# EAGLE design Placa principal (EAGLE 7.6.0)
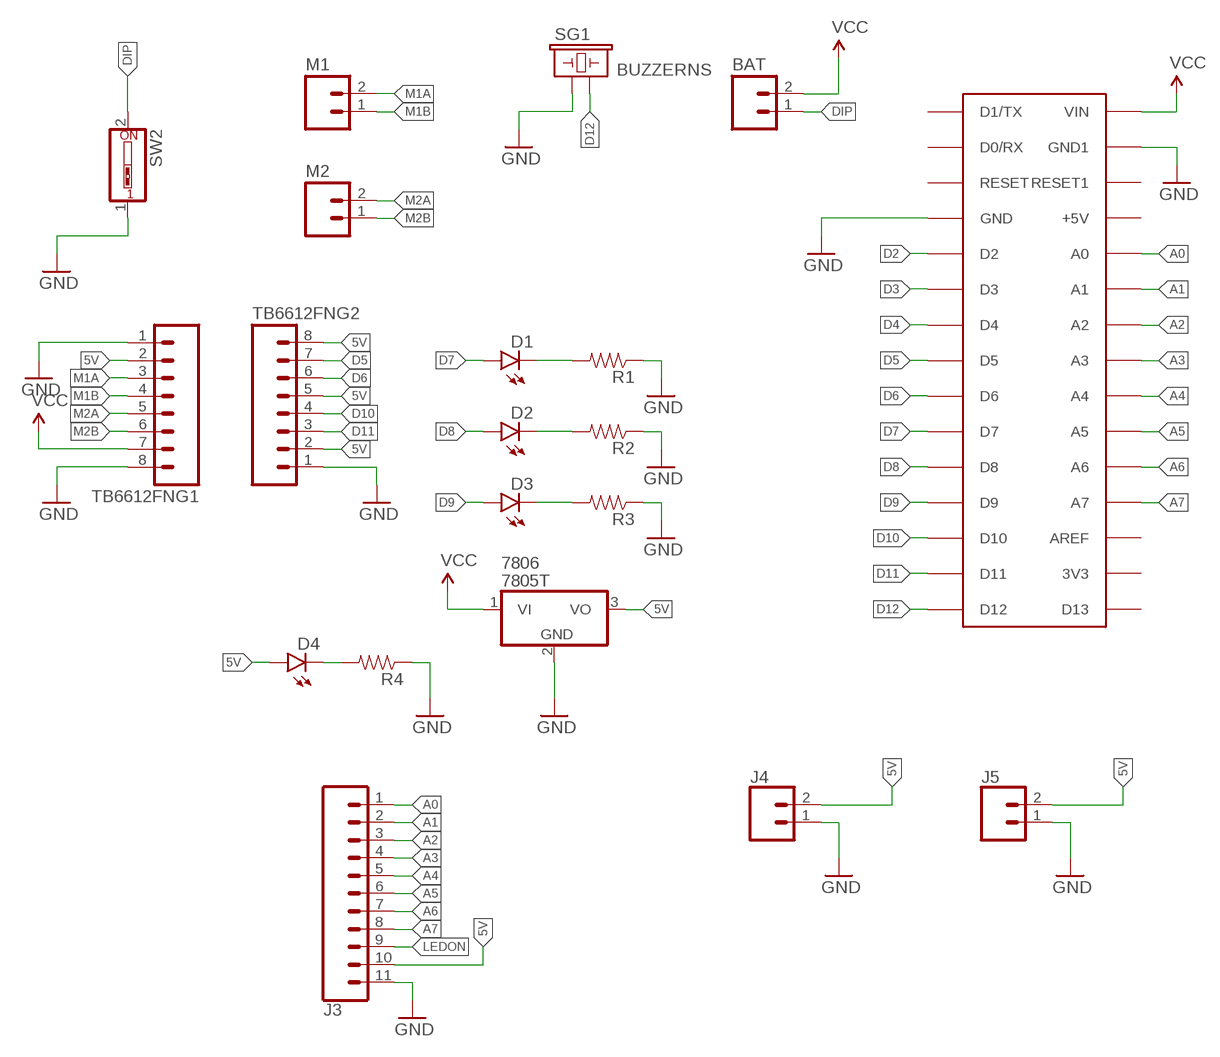
[diagram p0: schematic, sheet 1]

## Parts
7806  7805T  [TO220H]
BAT  M02PTH  [1X02@1]
D1  LED5MM  [LED5MM]
D2  LED5MM  [LED5MM]
D3  LED5MM  [LED5MM]
D4  LED5MM  [LED5MM]
J3  CONN_11  [1X11]
J4  CONN_02  [1X02]
J5  CONN_02  [1X02]
M1  M02JST-PTH-VERT  [JST-2-PTH-VERT]
M2  M02JST-PTH-VERT  [JST-2-PTH-VERT]
R1  RESISTOREZ  [AXIAL-0.3EZ]
R2  RESISTOREZ  [AXIAL-0.3EZ]
R3  RESISTOREZ  [AXIAL-0.3EZ]
R4  RESISTOREZ  [AXIAL-0.3EZ]
SG1  BUZZERNS  [BUZZER-12MM-NS]
SW2  SW_DIP-1  [EDG-01]
TB6612FNG1  M08  [1X08_ROUND]
TB6612FNG2  M08  [1X08_ROUND]
U1  NANO  ARDUINONANO  [PDIP-32]

## Nets
5V: 7806.3(VO) D4.A J3.10 J4.2 J5.2 TB6612FNG1.2 TB6612FNG2.2 TB6612FNG2.5 TB6612FNG2.8
A0: J3.1 U1.A0
A1: J3.2 U1.A1
A2: J3.3 U1.A2
A3: J3.4 U1.A3
A4: J3.5 U1.A4
A5: J3.6 U1.A5
A6: J3.7 U1.A6
A7: J3.8 U1.A7
D2: U1.D2
D3: U1.D3
D4: U1.D4
D5: TB6612FNG2.7 U1.D5
D6: TB6612FNG2.6 U1.D6
D7: D1.A U1.D7
D8: D2.A U1.D8
D9: D3.A U1.D9
D10: TB6612FNG2.4 U1.D10
D11: TB6612FNG2.3 U1.D11
D12: SG1.- U1.D12
DIP: BAT.1 SW2.2
GND: 7806.2(GND) J3.11 J4.1 J5.1 R1.P$1 R2.P$1 R3.P$1 R4.P$1 SG1.+ SW2.1 TB6612FNG1.1 TB6612FNG1.8 TB6612FNG2.1 U1.GND U1.GND1
LEDON: J3.9
M1A: M1.2 TB6612FNG1.3
M1B: M1.1 TB6612FNG1.4
M2A: M2.2 TB6612FNG1.5
M2B: M2.1 TB6612FNG1.6
N$2: D4.K(C) R4.P$2
N$4: D1.K(C) R1.P$2
N$5: D2.K(C) R2.P$2
N$6: D3.K(C) R3.P$2
VCC: 7806.1(VI) BAT.2 TB6612FNG1.7 U1.VIN
Unconnected: U1.3V3 U1.+5V U1.AREF U1.D0/RX U1.D1/TX U1.D13 U1.RESET U1.RESET1

## Library data of the parts
7806 = linear:78*: Positive VOLTAGE REGULATOR Source: http://cache.national.com/ds/LM/LM78L05.pdf http://www.fairchildsemi.com/ds/LM/LM7805.pdf
BAT M1 M2 = SparkFun-Connectors:M02: Standard 2-pin 0.1" header. Use with - straight break away headers ( PRT-00116) - right angle break away headers (PRT-00553) - swiss pins (PRT-00743) - machine pins (PRT-00117) - female headers (PRT-00115) Molex polarized connector foot print use with: PRT-08233 with associated crimp pins and housings. 2.54_SCREWTERM for use with PRT-10571. 3.5mm Screw Terminal footprints for PRT-08084 5mm Screw Terminal footprints for use with PRT-08432
D1-D4 = SparkFun-LED:LED: LEDs Standard schematic elements and footprints for 5mm, 3mm, 1206, and 0603 sized LEDs. 5mm - Spark Fun Electronics SKU : COM-00529 (and others)
J3 = SparkFun-Connectors:CONN_11: Multi connection point. Often used as Generic Header-pin footprint for 0.1 inch spaced/style header connections On any of the 0.1 inch spaced packages, you can populate with these: Break Away Headers - Straight <https://www.sparkfun.com/products/116> (PRT-00116) Break Away Male Headers - Right Angle <https://www.sparkfun.com/products/553> (PRT-00553) Female Headers <https://www.sparkfun.com/products/115> (PRT-00115) Break Away Headers - Machine Pin <https://www.sparkfun.com/products/117> (PRT-00117) Break Away Female Headers - Swiss Machine Pin <https://www.sparkfun.com/products/743> (PRT-00743) For SCREWTERMINALS and SPRING TERMINALS visit here: Screw Terimnals on SparkFun.com <https://www.sparkfun.com/search/results?term=Screw+Terminals> (5mm/3.5mm/2.54mm spacing) This device is also useful as a general connection point to wire up your design to another part of your project. Our various solder wires solder well into these plated through hole pads. Hook-Up Wire - Assortment (Stranded, 22 AWG) <https://www.sparkfun.com/products/11375> (PRT-11375) Hook-Up Wire - Assortment (Solid Core, 22 AWG) <https://www.sparkfun.com/products/11367> (PRT-11367) View the entire wire category on our website here <https://www.sparkfun.com/categories/141>
J4 J5 = SparkFun-Connectors:CONN_02: Multi connection point. Often used as Generic Header-pin footprint for 0.1 inch spaced/style header connections On any of the 0.1 inch spaced packages, you can populate with these: Break Away Headers - Straight <https://www.sparkfun.com/products/116> (PRT-00116) Break Away Male Headers - Right Angle <https://www.sparkfun.com/products/553> (PRT-00553) Female Headers <https://www.sparkfun.com/products/115> (PRT-00115) Break Away Headers - Machine Pin <https://www.sparkfun.com/products/117> (PRT-00117) Break Away Female Headers - Swiss Machine Pin <https://www.sparkfun.com/products/743> (PRT-00743) For SCREWTERMINALS and SPRING TERMINALS visit here: Screw Terimnals on SparkFun.com <https://www.sparkfun.com/search/results?term=Screw+Terminals> (5mm/3.5mm/2.54mm spacing) This device is also useful as a general connection point to wire up your design to another part of your project. Our various solder wires solder well into these plated through hole pads. Hook-Up Wire - Assortment (Stranded, 22 AWG) <https://www.sparkfun.com/products/11375> (PRT-11375) Hook-Up Wire - Assortment (Solid Core, 22 AWG) <https://www.sparkfun.com/products/11367> (PRT-11367) View the entire wire category on our website here <https://www.sparkfun.com/categories/141> Special notes: Molex polarized connector foot print use with: PRT-08233 with associated crimp pins and housings. 2.54_SCREWTERM for use with PRT-10571. 3.5mm Screw Terminal footprints for PRT-08084 5mm Screw Terminal footprints for use with PRT-08432
R1-R4 = SparkFun-Resistors:RESISTOR: Resistor Basic schematic elements and footprints for 0603, 1206, and PTH resistors.
SG1 = SparkFun-Electromechanical:BUZZER: Buzzer 12mm Spark Fun Electronics SKU : Comp-Buzzer
SW2 = special:SW_DIP-1: DIP SWITCH
TB6612FNG1 TB6612FNG2 = SparkFun-Connectors:M08: Header 8 Standard 8-pin 0.1" header. Use with straight break away headers (SKU : PRT-00116), right angle break away headers (PRT-00553), swiss pins (PRT-00743), machine pins (PRT-00117), and female headers (PRT-00115).; PROD_ID: CONN-08437
U1 = jet-lib:ARDUINONANO

## Board
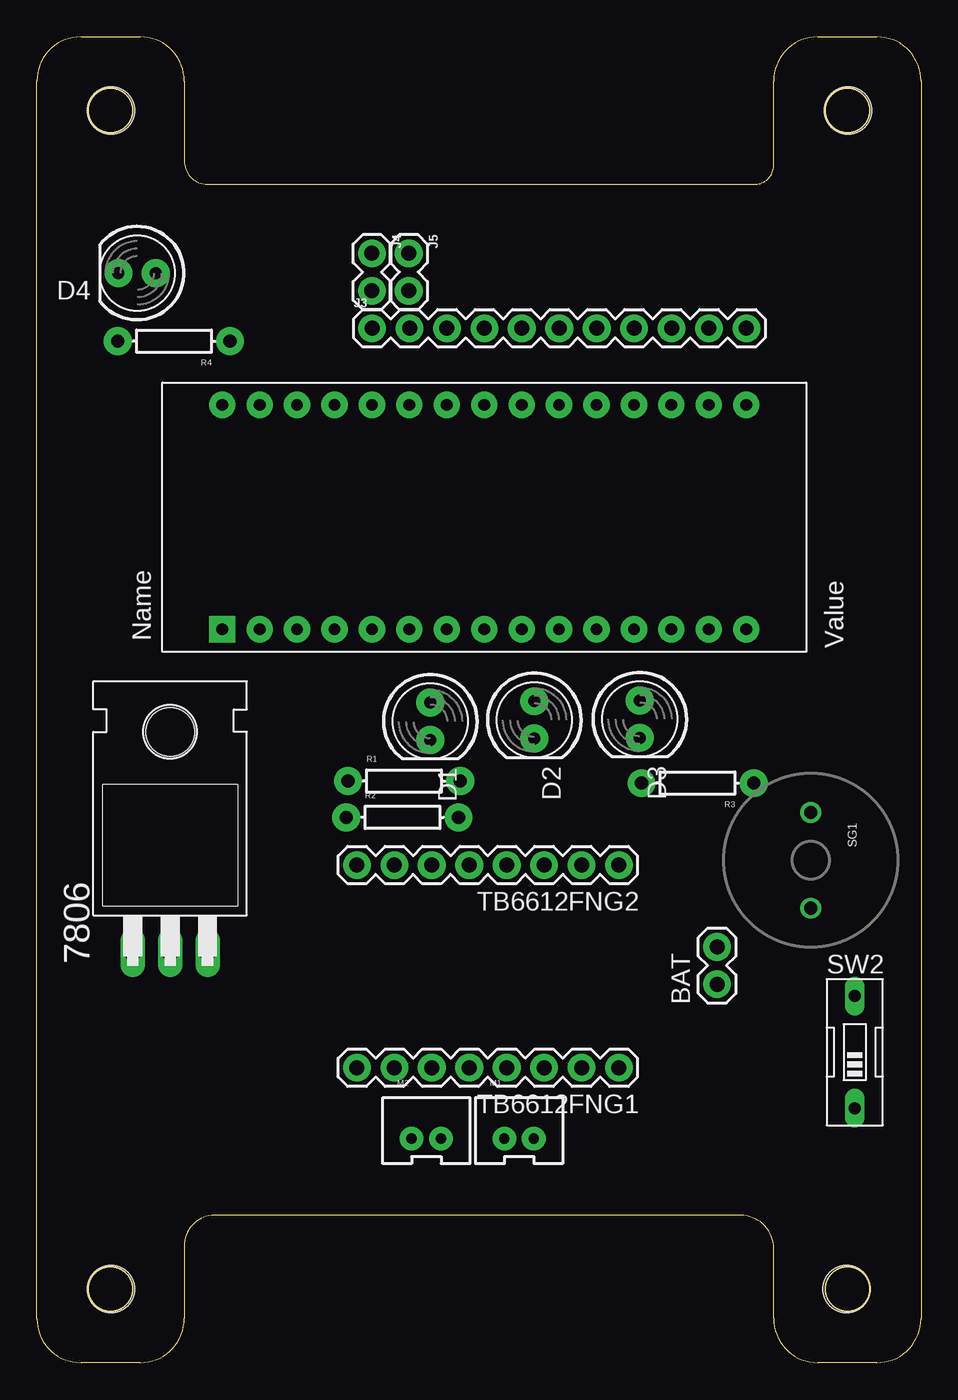
[diagram p1: board, top side]
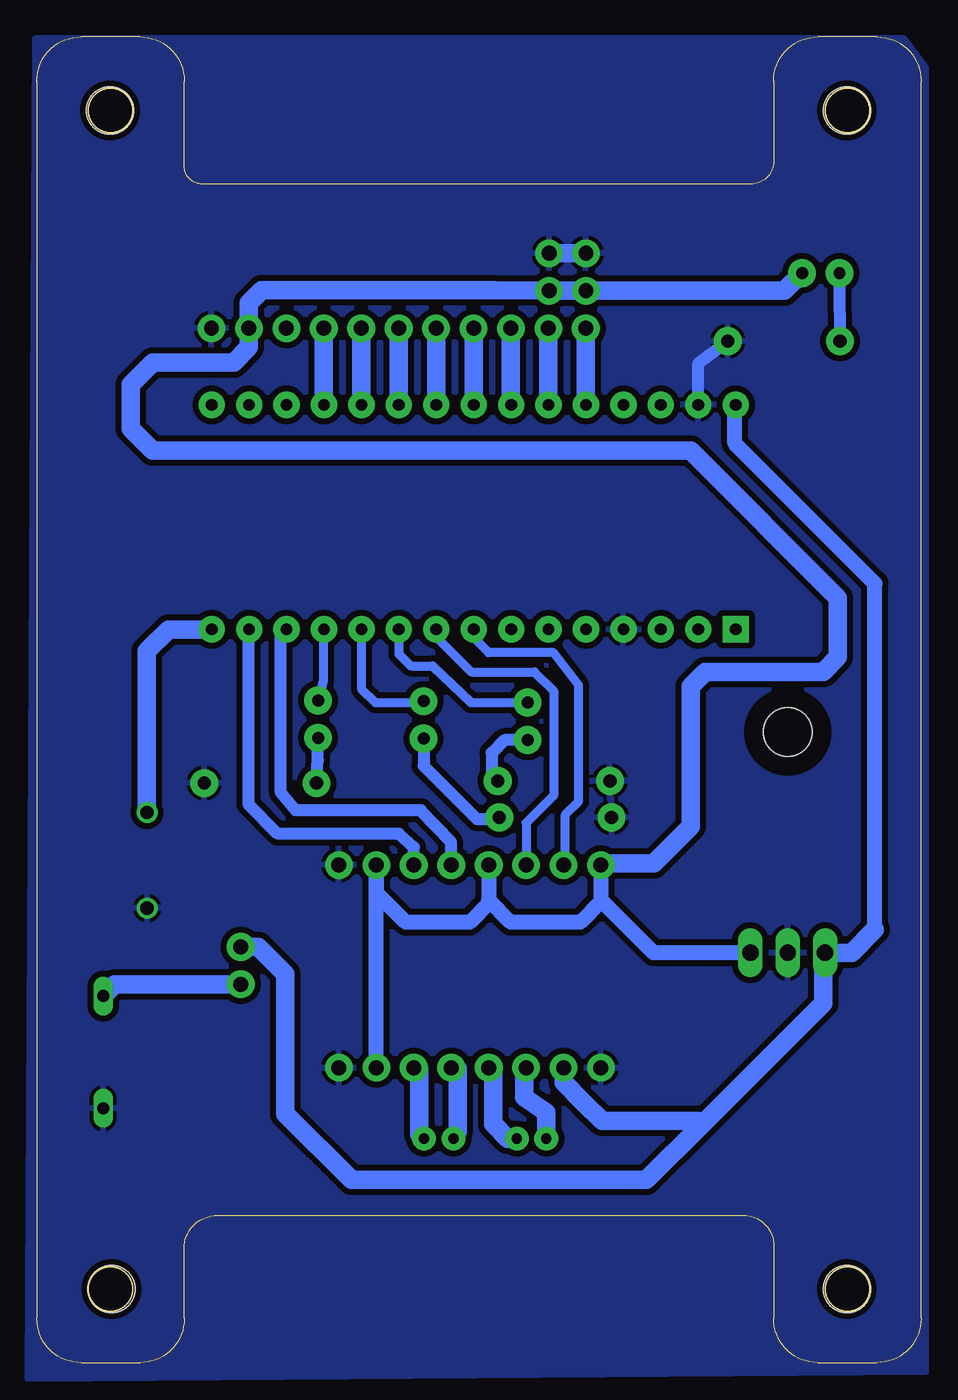
[diagram p2: board, bottom side, seen from below]

Size 60 x 90 mm. Coordinates in mm from the lower left corner, seen from the top.
Outline: 53,90 57,90 arc-90 60,87 60,3 arc-90 57,0 53,0 arc-90 50,3 50,7.75 arc90 47.75,10 12.06,10 arc90 10,7.94 10,3 arc-90 7,0 3,0 arc-90 0,3 0,87 arc-90 3,90 7,90 arc-90 10,87 10,81.57 arc90 11.57,80 48.75,80 arc90 50,81.25 50,87 arc-90 53,90
Outline: circle at 5,85 radius 1.5
Outline: circle at 55,5 radius 1.5
Outline: circle at 55,85 radius 1.5
Outline: circle at 5,5 radius 1.5
Copper layers (1*16): Top 0.035mm / dielectric 1.5mm / Bottom 0.035mm
Design rules "default *": minimum track width 10mil, minimum drill 24mil, track to track 8mil, track to pad 8mil, pad to pad 8mil, via to via 8mil, smd to smd 8mil, copper to edge 0mil, drill to drill 8mil, minimum pad ring 10mil, minimum via ring 8mil, stop-mask expansion 4mil, vias tented up to drill 0mil, thermal gap 10mil
Holes 3.2 mm at 5.04,85 55.04,85 54.94,5 5.04,5

### Footprints (pad centres in the part's own frame; a part is rotated, then mirrored left to right if it is on the bottom)
TO220H = drill 1.118 long: 1 -2.54,-10.16; 2 0,-10.16; 3 2.54,-10.16 | hole 3.302: 0,4.826
1X02@1 = drill 1.016 pad 1.88: 1 0,0; 2 2.54,0
LED5MM = drill 0.813 pad 1.88: A -1.27,0; K 1.27,0
1X11 = drill 1.016 pad 1.88: 1 0,0; 2 2.54,0; 3 5.08,0; 4 7.62,0; 5 10.16,0; 6 12.7,0; 7 15.24,0; 8 17.78,0; 9 20.32,0; 10 22.86,0; 11 25.4,0
1X02 = drill 1.016 pad 1.88: 1 0,0; 2 2.54,0
JST-2-PTH-VERT = drill 0.7 pad 1.6: 1 -1,-0.55; 2 1,-0.55
AXIAL-0.3EZ = drill 0.9 pad 1.88: P$1 -3.81,0; P$2 3.81,0
BUZZER-12MM-NS = drill 0.9: + 3.25,0; - -3.25,0
EDG-01 = drill 0.813 long: 1 0,-3.81; 2 0,3.81
1X08_ROUND = drill 1.016 pad 1.88: 1 0,0; 2 2.54,0; 3 5.08,0; 4 7.62,0; 5 10.16,0; 6 12.7,0; 7 15.24,0; 8 17.78,0
PDIP-32 = drill 0.8 pad 1.778: 3V3 15.24,-35.56; +5V 15.24,-10.16; A0 15.24,-12.7; A1 15.24,-15.24; A2 15.24,-17.78; A3 15.24,-20.32; A4 15.24,-22.86; A5 15.24,-25.4; A6 15.24,-27.94; A7 15.24,-30.48; AREF 15.24,-33.02; D0/RX 0,-5.08; D2 0,-12.7; D3 0,-15.24; D4 0,-17.78; D5 0,-20.32; D6 0,-22.86; D7 0,-25.4; D8 0,-27.94; D9 0,-30.48; D10 0,-33.02; D11 0,-35.56; D12 0,-38.1; D13 15.24,-38.1; GND 0,-10.16; GND1 15.24,-5.08; RESET 0,-7.62; RESET1 15.24,-7.62; VIN 15.24,-2.54 | drill 0.8 pad 1.778 square: D1/TX 0,-2.54

### Placement (x,y rotation side)
7806  9.05,37.99 0 top
BAT  46.16,25.69 90 top
D1  26.7,43.54 270 top
D2  33.76,43.64 270 top
D3  40.91,43.68 270 top
D4  6.8,73.96 180 top
J3  22.75,70.21 0 top
J4  22.74,75.3 270 top
J5  25.24,75.3 270 top
M1  32.72,15.75 0 top
M2  26.43,15.75 0 top
R1  24.92,39.48 0 top
R2  24.81,37.01 0 top
R3  44.83,39.34 180 top
R4  9.3,69.34 180 top
SG1  52.52,34.11 270 top
SW2  55.5,21.08 0 top
TB6612FNG1  39.5,20.02 180 top
TB6612FNG2  39.5,33.78 180 top
U1  10.04,49.78 90 top

### Tracks (layer width: path | path; a pad name or v marks a point on that pad's centre or on a via)
5V
  Bottom 1.016: 7806.3 18.15,27.83 21.72,31.4 | TB6612FNG2.8 21.72,31.4 | 21.72,31.4 21.72,31.32 23.14,29.9 27.84,29.9 29.34,31.4 | TB6612FNG2.5 29.34,31.4 | 29.34,31.4 29.34,31.2 30.64,29.9 34.96,29.9 36.96,31.9 TB6612FNG2.2 TB6612FNG1.2
  Bottom 1.27: D4.A 9.28,72.76 J4.2 J5.2 28.98,72.8 44.74,72.8 45.61,71.93 J3.10 45.61,68.93 46.64,67.9 52.14,67.9 53.64,66.4 53.64,63.4 52.14,61.9 15.64,61.9 5.64,51.9 5.64,47.9 6.64,46.9 14.64,46.9 15.64,45.9 15.64,36.4 18.14,33.9 21.6,33.9 TB6612FNG2.8
A0
  Bottom 1.27: U1.A0 22.74,67.2 J3.1
A1
  Bottom 1.27: J3.2 25.29,65.03 U1.A1
A2
  Bottom 1.27: J3.3 27.83,65.03 U1.A2
A3
  Bottom 1.27: J3.4 30.37,65.03 U1.A3
A4
  Bottom 1.27: J3.5 32.91,65.03 U1.A4
A5
  Bottom 1.27: J3.6 35.45,65.03 U1.A5
A6
  Bottom 1.27: U1.A6 37.98,68.4 J3.7
A7
  Bottom 1.27: J3.8 40.53,65.03 U1.A7
D5
  Bottom 0.61: TB6612FNG2.7 24.14,33.9 24.14,37.2 23.24,38.1 23.24,46 24.94,48.2 29.34,48.2 30.36,49.22 U1.D5
D6
  Bottom 0.61: 32.9,49.26 30.54,46.9 26.24,46.9 24.94,45.6 24.94,38.5 26.8,36.64 TB6612FNG2.6
  Bottom 0.813: U1.D6 32.9,49.26 | 26.94,33.91 TB6612FNG2.6
D7
  Bottom 0.61: U1.D7 35.44,48.1 34.64,47.3 33.14,47.3 30.54,44.8 D1.A
  Bottom 0.813: D1.A
D8
  Bottom 0.61: U1.D8 37.98,45.74 37.04,44.8 33.86,44.8
  Bottom 0.813: 33.86,44.8 D2.A
D9
  Bottom 0.61: 40.91,44.92 40.54,46.3 40.54,49.76
  Bottom 0.813: D3.A 40.91,44.92 | 40.54,49.76 U1.D9
D10
  Bottom 0.813: TB6612FNG2.4 31.88,35.34 33.94,37.5 42.44,37.5 43.44,38.7 43.44,49.4 U1.D10
D11
  Bottom 0.813: TB6612FNG2.3 34.42,34.98 35.44,35.9 43.64,35.9 45.64,37.9 45.64,49.74 U1.D11
D12
  Bottom 1.27: U1.D12 51.06,49.78 52.54,48.3 52.54,37.38 SG1.-
DIP
  Bottom 0.61: 55.25,25.14 SW2.2
  Bottom 1.27: BAT.1 54.7,25.69 SW2.2
GND
  Bottom 0.813: U1.GND1 15.12,67.84 R4.P$1
  Bottom 1.27: J4.1 J5.1
  pour Bottom (isolate 0.406): 1.14,89.9 60.14,89.9 60.64,-1.1 -0.36,-0.6 -0.36,87.9
M1A
  Bottom 1.27: M1.2 33.74,15.2 34.04,15.5 34.04,19.99 TB6612FNG1.3
M1B
  Bottom 1.27: M1.1 31.72,15.42 31.44,15.7 31.44,19.93 TB6612FNG1.4
M2A
  Bottom 1.27: M2.2 28.04,15.2 29.04,16.2 29.04,19.97 TB6612FNG1.5
M2B
  Bottom 1.27: M2.1 25.43,16.99 26.94,18 26.94,20.01 TB6612FNG1.6
N$2
  Bottom 0.813: D4.K 5.53,71.88 R4.P$2
N$4
  Bottom 0.813: D1.K 28.27,42.27 29.14,41.4 29.14,39.89 R1.P$2
N$5
  Bottom 0.813: D2.K 33.76,40.52 30.14,36.9 28.73,36.9 R2.P$2
N$6
  Bottom 0.813: R3.P$2 40.92,40.9 D3.K
VCC
  Bottom 1.016: U1.VIN 12.64,64.96 12.64,62.4 3.14,52.9 3.14,29.4
  Bottom 1.27: 3.14,29.4 4.7,27.83 7806.1 6.64,27.7 6.64,24.4 14.89,16.15 | BAT.2 44.96,28.23 43.14,26.4 43.14,16.9 38.64,12.4 18.64,12.4 14.89,16.15 | TB6612FNG1.7 24.26,19.02 22.89,17.65 21.64,16.4 15.14,16.4 14.89,16.15